# EAGLE design shield-kentlcd (EAGLE 5.06)
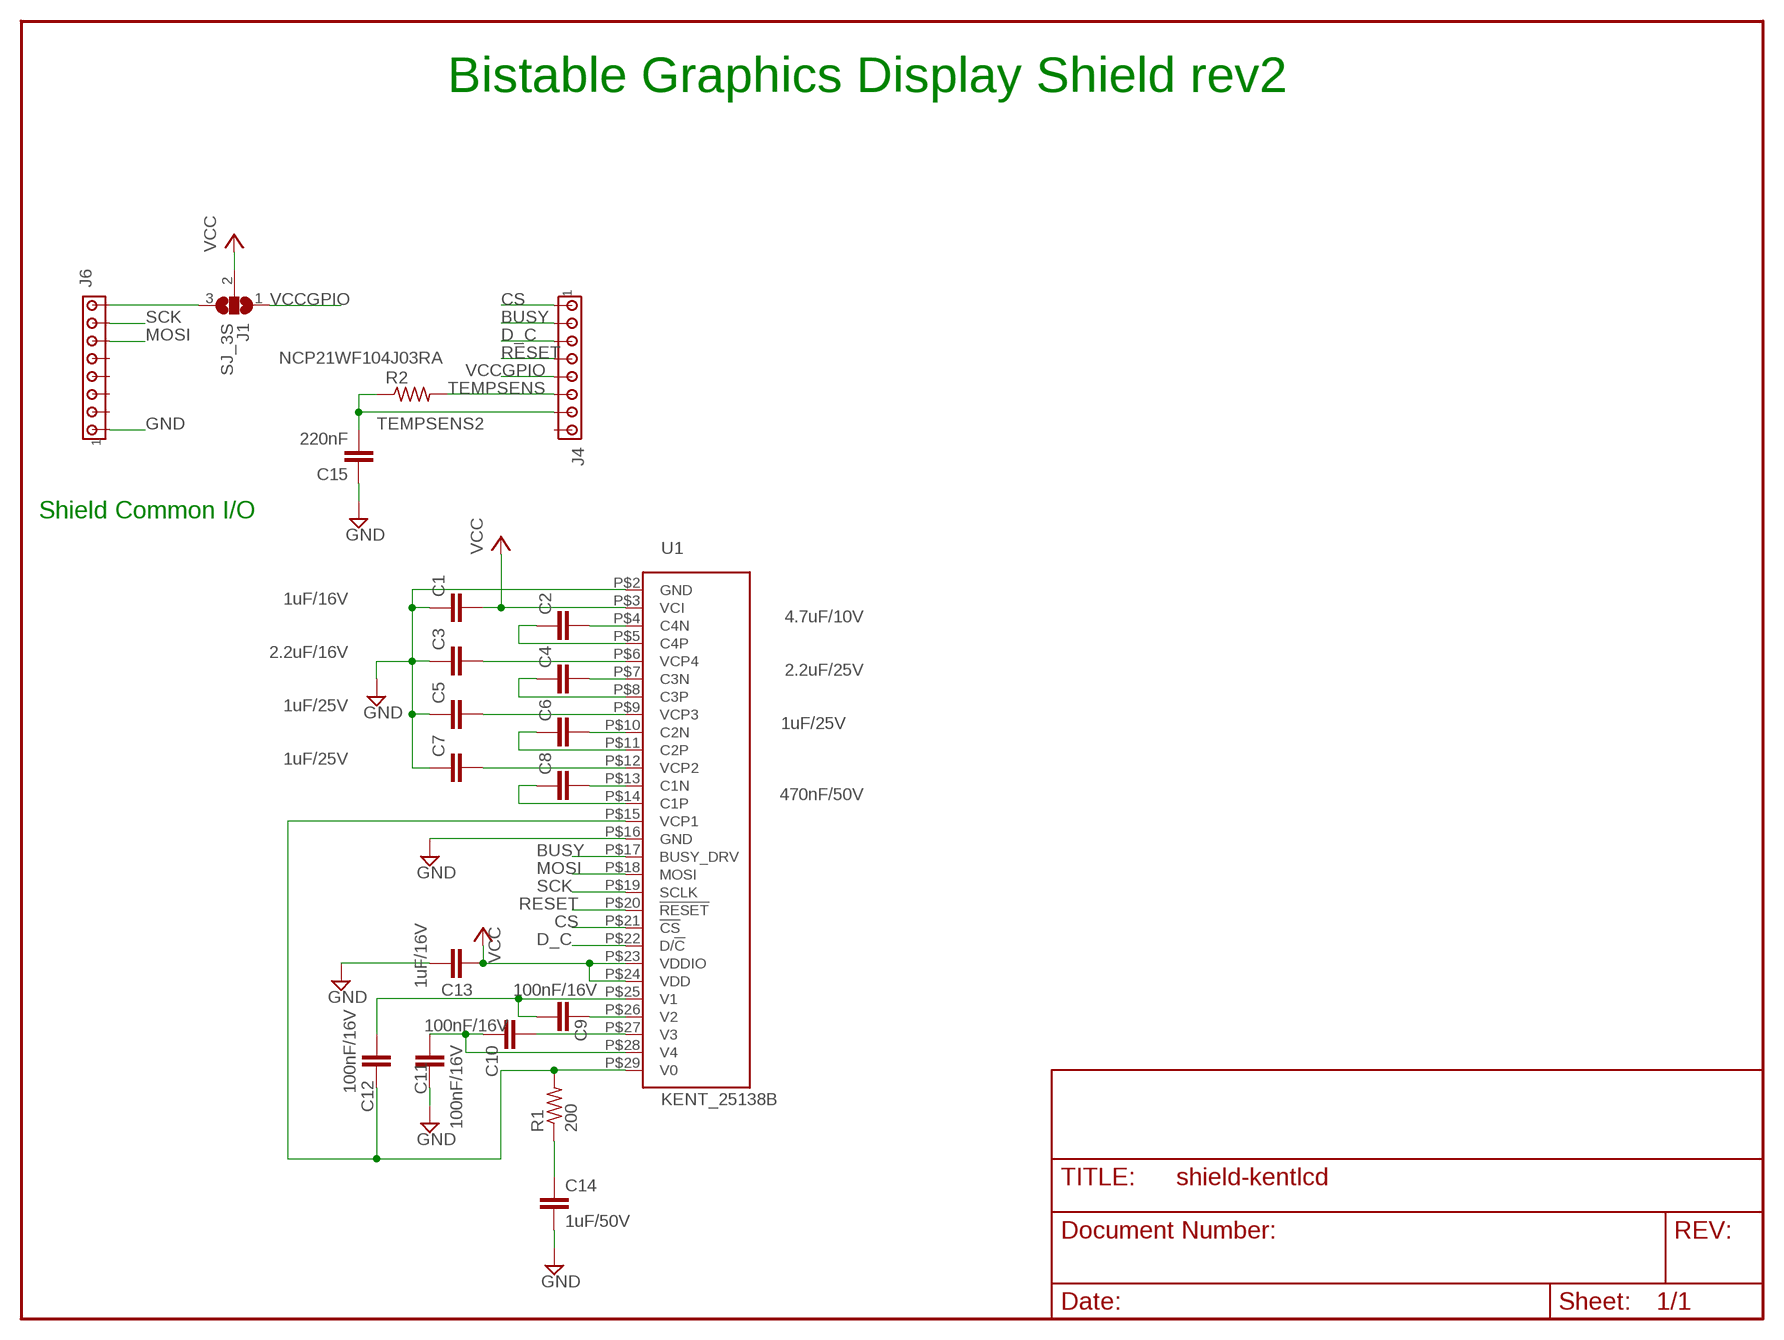
[diagram p0: schematic, sheet 1]

## Parts
C1  1uF/16V  C-EUC0805  [C0805]
C2  4.7uF/10V  C-EUC0805  [C0805]
C3  2.2uF/16V  C-EUC0805  [C0805]
C4  2.2uF/25V  C-EUC0805  [C0805]
C5  1uF/25V  C-EUC0805  [C0805]
C6  1uF/25V  C-EUC0805  [C0805]
C7  1uF/25V  C-EUC0805  [C0805]
C8  470nF/50V  C-EUC0805  [C0805]
C9  100nF/16V  C-EUC0805  [C0805]
C10  100nF/16V  C-EUC0805  [C0805]
C11  100nF/16V  C-EUC0805  [C0805]
C12  100nF/16V  C-EUC0805  [C0805]
C13  1uF/16V  C-EUC0805  [C0805]
C14  1uF/50V  C-EUC0805  [C0805]
C15  220nF  C-EUC0805  [C0805]
J1  SJ_3S  [SJ3_S]
J4  MTA08-100  [10X08MTA]
J6  MTA08-100  [10X08MTA]
R1  200  R-US_R0805  [R0805]
R2  NCP21WF104J03RA  R-US_R0805  [R0805]
U1  KENT_25138B  [KENT_25138B]

## Nets
BUSY: J4.2 U1.P$17(BUSY_DRV)
CS: J4.1 U1.P$21(!CS)
D_C: J4.3 U1.P$22(D/!C)
GND: C1.1 C3.1 C5.1 C7.1 C11.1 C13.1 C14.2 C15.1 J6.1 U1.P$2(GND) U1.P$16(GND)
MOSI: J6.6 U1.P$18(MOSI)
N$1: C12.1 R1.2 U1.P$15(VCP1) U1.P$29(V0)
N$2: C3.2 U1.P$6(VCP4)
N$3: C5.2 U1.P$9(VCP3)
N$4: C7.2 U1.P$12(VCP2)
N$5: C2.2 U1.P$4(C4N)
N$6: C4.2 U1.P$7(C3N)
N$7: C6.2 U1.P$10(C2N)
N$8: C8.2 U1.P$13(C1N)
N$9: C2.1 U1.P$5(C4P)
N$10: C4.1 U1.P$8(C3P)
N$11: C6.1 U1.P$11(C2P)
N$12: C8.1 U1.P$14(C1P)
N$14: C14.1 R1.1
N$15: C9.1 C12.2 U1.P$25(V1)
N$16: C9.2 U1.P$26(V2)
N$17: C10.2 U1.P$27(V3)
N$18: C10.1 C11.2 U1.P$28(V4)
N$20: J1.3 J6.8
RESET: J4.4 U1.P$20(!RESET)
SCK: J6.7 U1.P$19(SCLK)
TEMPSENS: J4.6 R2.2
TEMPSENS2: C15.2 J4.7 R2.1
VCC: C1.2 C13.2 J1.2 U1.P$3(VCI) U1.P$23(VDDIO) U1.P$24(VDD)
VCCGPIO: J1.1 J4.5
Unconnected: J4.8 J6.2 J6.3 J6.4 J6.5

## Notes on the sheet
- Bistable Graphics Display Shield rev2
- Shield Common I/O

## Library data of the parts
C1-C15 = rcl:C-EU: CAPACITOR, European symbol
J1 = mideeval:SJ_3S: Small solder jumper, 3 pin. 20060130 / tgipson
J4 J6 = con-amp:MTA08-100: AMP connector
R1 R2 = rcl:R-US_: RESISTOR, American symbol
U1 = tim:KENT_25138B

## Net classes
1 pwr: width 0.305 mm, drill 0.508 mm, clearance 0.203 mm
4 digital: width 0.203 mm, drill 0.381 mm, clearance 0.203 mm

## Board
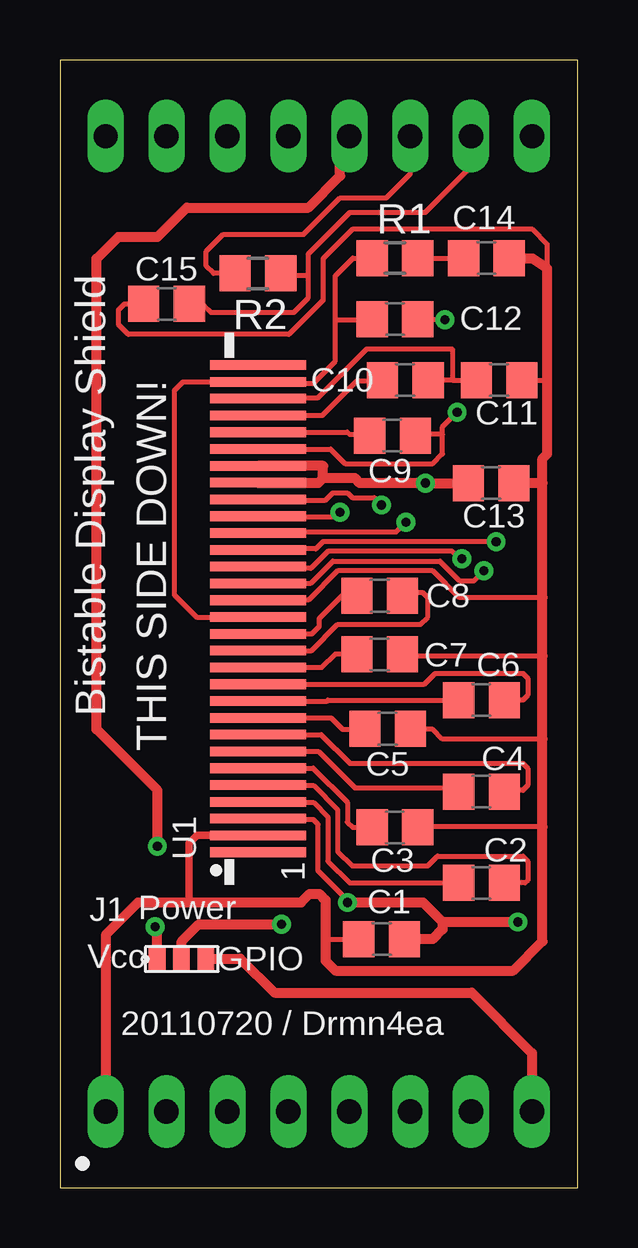
[diagram p1: board, top side]
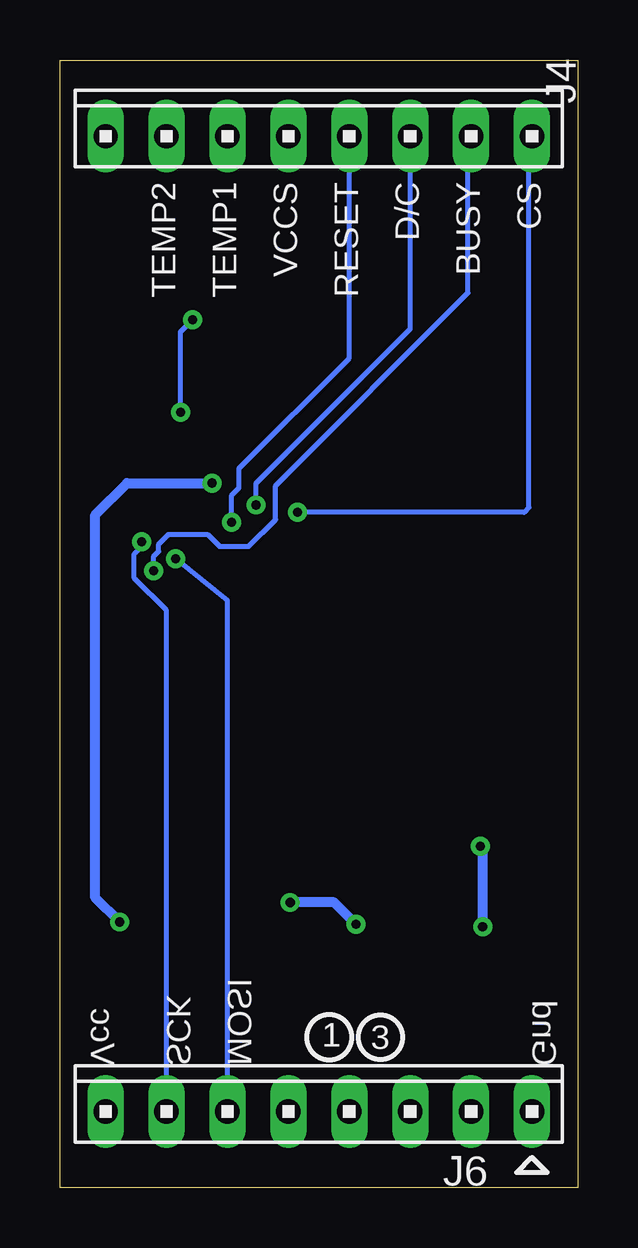
[diagram p2: board, bottom side, seen from below]

Size 21.59 x 46.99 mm. Coordinates in mm from the lower left corner, seen from the top.
Outline: 0,0 21.59,0 21.59,46.99 0,46.99 0,0
Copper layers (1*16): Top 0.035mm / dielectric 1.5mm / Bottom 0.035mm
Design rules "default": minimum track width 8mil, minimum drill 15mil, track to track 8mil, track to pad 8mil, pad to pad 8mil, via to via 8mil, smd to smd 8mil, copper to edge 40mil, drill to drill 8mil, minimum pad ring 10mil, minimum via ring 8mil, stop-mask expansion 4mil, vias tented up to drill 0mil, thermal gap 10mil

### Footprints (pad centres in the part's own frame; a part is rotated, then mirrored left to right if it is on the bottom)
C0805 = smd 1.3 x 1.5: 1 -0.95,0; 2 0.95,0
SJ3_S = smd 0.7 x 0.9: 1 -1.031,0; 2 -0.015,0; 3 1.001,0
10X08MTA = drill 1.016 long: 1 8.89,0; 2 6.35,0; 3 3.81,0; 4 1.27,0; 5 -1.27,0; 6 -3.81,0; 7 -6.35,0; 8 -8.89,0
R0805 = smd 1.3 x 1.5: 1 -0.95,0; 2 0.95,0
KENT_25138B = smd 0.4 x 4: P$1 10.15,0; P$2 9.45,0; P$3 8.75,0; P$4 8.05,0; P$5 7.35,0; P$6 6.65,0; P$7 5.95,0; P$8 5.25,0; P$9 4.55,0; P$10 3.85,0; P$11 3.15,0; P$12 2.45,0; P$13 1.75,0; P$14 1.05,0; P$15 0.35,0; P$16 -0.35,0; P$17 -1.05,0; P$18 -1.75,0; P$19 -2.45,0; P$20 -3.15,0; P$21 -3.85,0; P$22 -4.55,0; P$23 -5.25,0; P$24 -5.95,0; P$25 -6.65,0; P$26 -7.35,0; P$27 -8.05,0; P$28 -8.75,0; P$29 -9.45,0; P$30 -10.15,0

### Placement (x,y rotation side)
C1  13.41,10.36 0 top
C2  17.58,12.7 180 top
C3  13.97,15.01 180 top
C4  17.58,16.51 180 top
C5  13.67,19.13 180 top
C6  17.58,20.32 180 top
C7  13.34,22.23 180 top
C8  13.34,24.66 0 top
C9  13.87,31.34 180 top
C10  14.4,33.66 180 top
C11  18.31,33.66 180 top
C12  13.97,36.2 0 top
C13  17.98,29.36 180 top
C14  17.78,38.73 0 top
C15  4.45,36.83 0 top
J1  5.08,9.53 0 top
J4  10.79,43.81 0 bottom
J6  10.79,3.17 0 bottom
R1  13.97,38.73 180 top
R2  8.26,38.1 180 top
U1  8.26,24.13 270 top

### Tracks (layer width: path | path; a pad name or v marks a point on that pad's centre or on a via)
BUSY  (via drill 0.38)
  Top 0.203: U1.P$17 8.27,25.2 10.46,25.2 11.38,26.11 15.85,26.11 16.66,25.3 17.27,25.3 v17.68,25.7
  Bottom 0.203: v17.68,25.7 17.68,26.31 17.48,26.52 17.48,26.82 17.07,27.23 15.44,27.23 14.94,26.72 13.72,26.72 12.6,27.84 12.6,29.26 4.57,37.29 4.57,43.69 J4.2
CS  (via drill 0.38)
  Top 0.203: U1.P$21 8.29,27.94 11.48,27.94 v11.68,28.14
  Bottom 0.203: v11.68,28.14 2.23,28.14 2.03,28.35 2.03,43.69 J4.1
D_C  (via drill 0.38)
  Top 0.203: U1.P$22 8.28,28.65 11.07,28.65 11.38,28.96 11.99,28.96 12.19,28.75 13.11,28.75 v13.41,28.45
  Bottom 0.203: v13.41,28.45 13.41,29.36 6.99,35.79 J4.3
GND
  Top 0.203: 8.3,14.63 U1.P$2 | C3.1 15.25,15.04 20.12,15.04 | C5.1 14.9,19.1 15.54,19.1 15.95,18.69 20.12,18.69 | C7.1 14.29,22.15 20.12,22.15 | U1.P$16 10.36,24.49 11.58,25.7 15.54,25.7 16.66,24.59 20.12,24.59 | C11.1 19.32,33.63 20.32,33.63 | 18.68,38.71 C14.2 | C15.1 2.69,36.83 2.44,36.58 2.44,35.97 2.85,35.56 9.55,35.56 10.97,36.98 10.97,38.71 12.19,39.93 19.71,39.93 20.32,39.32 20.32,38.2 | 11.07,10.36 C1.1
  Top 0.305: 8.3,14.63 U1.P$2 5.71,14.68 5.38,14.35 5.38,11.89
  Top 0.406: 20.12,29.36 20.12,24.59 20.12,22.15 20.12,18.69 20.12,15.04 20.12,10.26 18.9,9.04 11.48,9.04 11.07,9.45 11.07,10.36 11.07,11.99 10.82,12.24 10.41,12.24 10.06,11.89 5.38,11.89 3.25,11.89 1.93,10.57 1.93,3.2 J6.1 | 20.12,29.36 20.12,30.38 20.32,30.58 20.32,33.63 20.32,38.2 20.32,38.3 19.71,38.71 18.68,38.71 | 20.12,29.36 C13.1
MOSI  (via drill 0.38)
  Top 0.203: U1.P$18 8.33,25.81 10.46,25.81 11.18,26.52 16.36,26.52 16.66,26.21 v16.76,26.21
  Bottom 0.203: v16.76,26.21 14.61,24.46 J6.6
N$1
  Top 0.203: 11.48,36.17 11.48,34.44 10.57,33.53 8.31,33.53 U1.P$29 5.13,33.58 4.78,33.22 4.78,24.69 5.69,23.77 U1.P$15 | 11.48,36.17 11.48,38 12.22,38.73 R1.2 | C12.1 13.07,36.17 11.48,36.17
N$2
  Top 0.203: C3.2 12.22,15.01 11.99,15.24 11.99,16.05 10.56,17.48 U1.P$6
N$3
  Top 0.203: C5.2 12.92,18.69 12.41,19.1 11.79,19.1 11.31,19.58 U1.P$9
N$4
  Top 0.203: C7.2 12.44,22.25 11.48,22.25 10.91,21.68 U1.P$12
N$5
  Top 0.203: U1.P$4 8.28,16.05 10.57,16.05 11.18,15.44 11.18,13.61 12.09,12.7 C2.2
N$6
  Top 0.203: C4.2 16.75,16.66 12.29,16.66 10.78,18.18 U1.P$7
N$7
  Top 0.203: C6.2 11.18,20.32 11.14,20.28 U1.P$10
N$8
  Top 0.203: C8.2 14.23,24.79 15.14,24.79 15.34,24.59 15.34,23.77 15.04,23.47 11.58,23.47 10.49,22.38 U1.P$13
N$9
  Top 0.203: U1.P$5 8.27,16.76 10.57,16.76 11.58,15.75 11.58,14.02 12.19,13.41 15.34,13.41 15.75,13.82 19.3,13.82 19.51,13.61 19.51,12.8 19.41,12.7 C2.1
N$10
  Top 0.203: C4.1 18.71,16.56 19.3,16.56 19.51,16.76 19.51,17.48 19.3,17.68 12.09,17.68 10.89,18.88 U1.P$8
N$11
  Top 0.203: C6.1 19.3,20.32 19.51,20.52 19.51,21.23 19.3,21.44 15.65,21.44 15.19,20.98 U1.P$11
N$12
  Top 0.203: C8.1 12.38,24.69 11.79,24.69 10.82,23.72 10.82,23.39 10.51,23.08 U1.P$14
N$14
  Top 0.203: R1.1 C14.1
N$15  (via drill 0.38)
  Top 0.203: C9.1 15.4,31.39 15.95,31.39 | 15.95,31.39 15.95,30.58 15.54,30.18 11.89,30.18 11.28,30.78 U1.P$25 | 15.95,31.39 15.95,31.7 v16.56,32.31 | C12.2 14.87,36.17 v16.05,36.17
  Bottom 0.203: v16.05,36.17 16.56,35.66 v16.56,32.31
N$16
  Top 0.203: C9.2 12.84,31.39 12.09,31.39 11.97,31.48 U1.P$26
N$17
  Top 0.203: C10.2 13.71,33.63 12.39,33.63 10.95,32.18 U1.P$27
N$18
  Top 0.203: 16.36,33.66 C11.2 | 16.36,33.66 C10.1 | U1.P$28 8.29,32.92 10.77,32.92 12.8,34.95 16.36,34.95 16.36,33.66
N$20
  Top 0.406: J1.3 6.11,9.55 7.52,9.55 8.94,8.13 17.17,8.13 19.68,5.61 J6.8
RESET  (via drill 0.38)
  Top 0.203: U1.P$20 8.3,27.33 14.02,27.33 v14.43,27.74
  Bottom 0.203: v14.43,27.74 14.43,28.85 14.12,29.16 14.12,29.97 9.53,34.57 J4.4
SCK  (via drill 0.38)
  Top 0.203: U1.P$19 8.29,26.62 10.67,26.62 10.97,26.92 v18.19,26.92
  Bottom 0.203: J6.7 17.14,24.05 18.49,25.4 18.49,26.42 17.98,26.92 v18.19,26.92
TEMPSENS
  Top 0.203: R2.2 6.4,38.1 6.1,38.41 6.1,39.01 6.81,39.73 10.16,39.73 11.68,41.25 13.61,41.25 14.61,42.24 J4.6
TEMPSENS2
  Top 0.203: C15.2 5.37,36.78 5.99,36.78 6.3,36.47 9.75,36.47 10.36,37.08 10.36,38 | 10.36,38 10.36,38.91 12.09,40.64 15.24,40.64 17.14,42.55 J4.7 | R2.1 9.31,38 10.36,38
VCC  (via drill 0.38)
  Top 0.203: U1.P$3 8.29,15.34 10.57,15.34 10.77,15.14 10.77,13.21 11.99,11.99 v11.99,11.89
  Top 0.406: U1.P$24 10.97,30.07 10.97,29.57 | U1.P$23 8.27,29.36 10.77,29.36 10.97,29.57 | J1.2 5.08,10.26 5.79,10.97 v9.25,10.97 | v11.99,11.89 15.14,11.89 15.95,11.07 | 15.95,11.07 v19.1,11.07 | C1.2 15.54,10.36 15.95,10.77 15.95,11.07 | 10.97,29.57 12.29,29.57 12.5,29.36 15.14,29.36 15.29,29.52 15.29,29.41 v15.24,29.36 C13.2
  Bottom 0.406: v19.1,11.07 20.12,12.09 20.12,28.04 18.8,29.36 v15.24,29.36 | v9.25,10.97 10.16,11.89 v11.99,11.89
VCCGPIO  (via drill 0.38)
  Top 0.406: J4.5 11.68,43.43 11.68,42.16 10.36,40.84 5.28,40.84 4.06,39.62 2.44,39.62 1.52,38.71 1.52,19.1 4.06,16.56 v4.06,14.22 | v3.96,10.87 4.05,10.79 J1.1
  Bottom 0.406: v4.06,14.22 3.96,14.12 v3.96,10.87

### Text on the board
tPlace: Power | Vcc | GPIO
tNames: Bistable Display Shield | THIS SIDE DOWN! | 20110720 / Drmn4ea
bNames: CS | BUSY | D/C | RESET | VCCS | TEMP1 | TEMP2 | 3 | 1 | Gnd | MOSI | SCK | Vcc